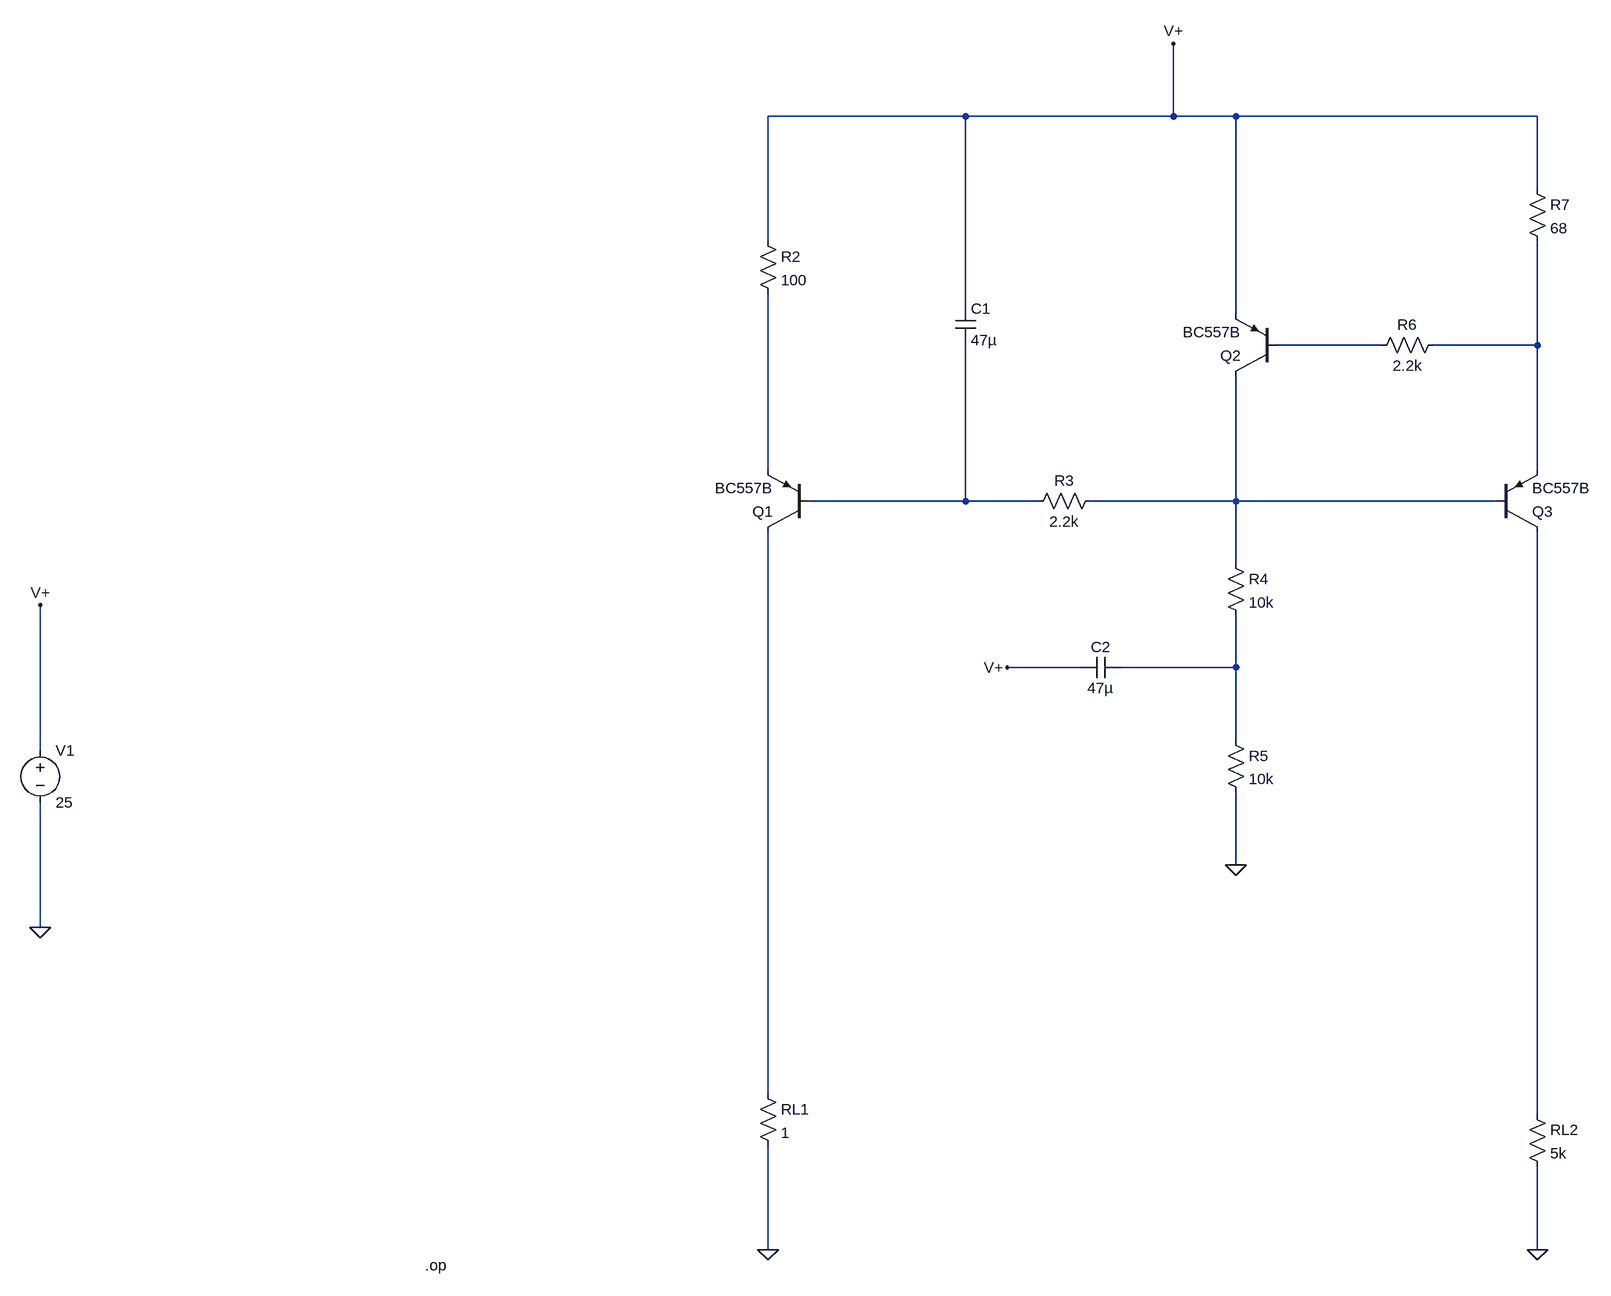
[diagram p0: schematic fte_corriente_ds.asc]
fte_corriente_ds.asc, the LTspice schematic file:
Version 4
SHEET 1 4564 1376
WIRE 1632 -4608 1328 -4608
WIRE 1952 -4608 1952 -4720
WIRE 1952 -4608 1632 -4608
WIRE 2048 -4608 1952 -4608
WIRE 2512 -4608 2048 -4608
WIRE 2512 -4496 2512 -4608
WIRE 1328 -4416 1328 -4608
WIRE 1632 -4320 1632 -4608
WIRE 2048 -4304 2048 -4608
WIRE 2272 -4256 2112 -4256
WIRE 2512 -4256 2512 -4416
WIRE 2512 -4256 2352 -4256
WIRE 1328 -4064 1328 -4336
WIRE 2512 -4064 2512 -4256
WIRE 1632 -4016 1632 -4256
WIRE 1632 -4016 1392 -4016
WIRE 1744 -4016 1632 -4016
WIRE 2048 -4016 2048 -4208
WIRE 2048 -4016 1824 -4016
WIRE 2448 -4016 2048 -4016
WIRE 2048 -3920 2048 -4016
WIRE 1808 -3760 1696 -3760
WIRE 2048 -3760 2048 -3840
WIRE 2048 -3760 1872 -3760
WIRE 2048 -3648 2048 -3760
WIRE 208 -3632 208 -3856
WIRE 2048 -3456 2048 -3568
WIRE 208 -3360 208 -3552
WIRE 1328 -3104 1328 -3968
WIRE 2512 -3072 2512 -3968
WIRE 1328 -2864 1328 -3024
WIRE 2512 -2864 2512 -2992
FLAG 208 -3360 0
FLAG 1328 -2864 0
FLAG 2512 -2864 0
FLAG 2048 -3456 0
FLAG 208 -3856 V+
FLAG 1696 -3760 V+
FLAG 1952 -4720 V+
DATAFLAG 1328 -3760 ""
DATAFLAG 1328 -4208 ""
DATAFLAG 1552 -4016 ""
DATAFLAG 2512 -3872 ""
DATAFLAG 2512 -4160 ""
DATAFLAG 2048 -4416 ""
DATAFLAG 2192 -4256 ""
DATAFLAG 2512 -3296 "I(Rl2)"
DATAFLAG 1328 -3312 "I(Rl1)"
DATAFLAG 2048 -3760 "I(R5)"
DATAFLAG 2048 -4016 ""
DATAFLAG 2048 -4608 ""
DATAFLAG 2512 -4352 "I(R7)"
SYMBOL pnp 1392 -3968 R180
SYMATTR InstName Q1
SYMATTR Value BC557B
SYMBOL pnp 2112 -4208 R180
SYMATTR InstName Q2
SYMATTR Value BC557B
SYMBOL pnp 2448 -3968 M180
SYMATTR InstName Q3
SYMATTR Value BC557B
SYMBOL res 1312 -4432 R0
SYMATTR InstName R2
SYMATTR Value 100
SYMBOL res 1840 -4032 R90
WINDOW 0 0 56 VBottom 2
WINDOW 3 32 56 VTop 2
SYMATTR InstName R3
SYMATTR Value 2.2k
SYMBOL res 2256 -4240 R270
WINDOW 0 32 56 VTop 2
WINDOW 3 0 56 VBottom 2
SYMATTR InstName R6
SYMATTR Value 2.2k
SYMBOL res 2496 -4512 R0
SYMATTR InstName R7
SYMATTR Value 68
SYMBOL res 1312 -3120 R0
SYMATTR InstName RL1
SYMATTR Value 1
SYMBOL res 2496 -3088 R0
SYMATTR InstName RL2
SYMATTR Value 5k
SYMBOL voltage 208 -3648 R0
WINDOW 123 0 0 Left 0
WINDOW 39 0 0 Left 0
SYMATTR InstName V1
SYMATTR Value 25
SYMBOL cap 1616 -4320 R0
SYMATTR InstName C1
SYMATTR Value 47µ
SYMBOL cap 1808 -3744 R270
WINDOW 0 32 32 VTop 2
WINDOW 3 0 32 VBottom 2
SYMATTR InstName C2
SYMATTR Value 47µ
SYMBOL res 2032 -3936 R0
SYMATTR InstName R4
SYMATTR Value 10k
SYMBOL res 2032 -3664 R0
SYMATTR InstName R5
SYMATTR Value 10k
TEXT 800 -2840 Left 2 !.op

The netlist it stands for:
* fte_corriente_ds.asc
Q1 N007 N004 N003 0 BC557B
Q2 N005 N001 V+ 0 BC557B
Q3 N008 N005 N002 0 BC557B
R2 V+ N003 100
R3 N005 N004 2.2k
R6 N001 N002 2.2k
R7 V+ N002 68
RL1 N007 0 1
RL2 N008 0 5k
V1 V+ 0 25
C1 V+ N004 47µ
C2 V+ N006 47µ
R4 N005 N006 10k
R5 N006 0 10k
.model NPN NPN
.model PNP PNP
.lib standard.bjt
.op
.backanno
.end